# EAGLE design Miasma_fpb_R1_0 (EAGLE 6.6.0)
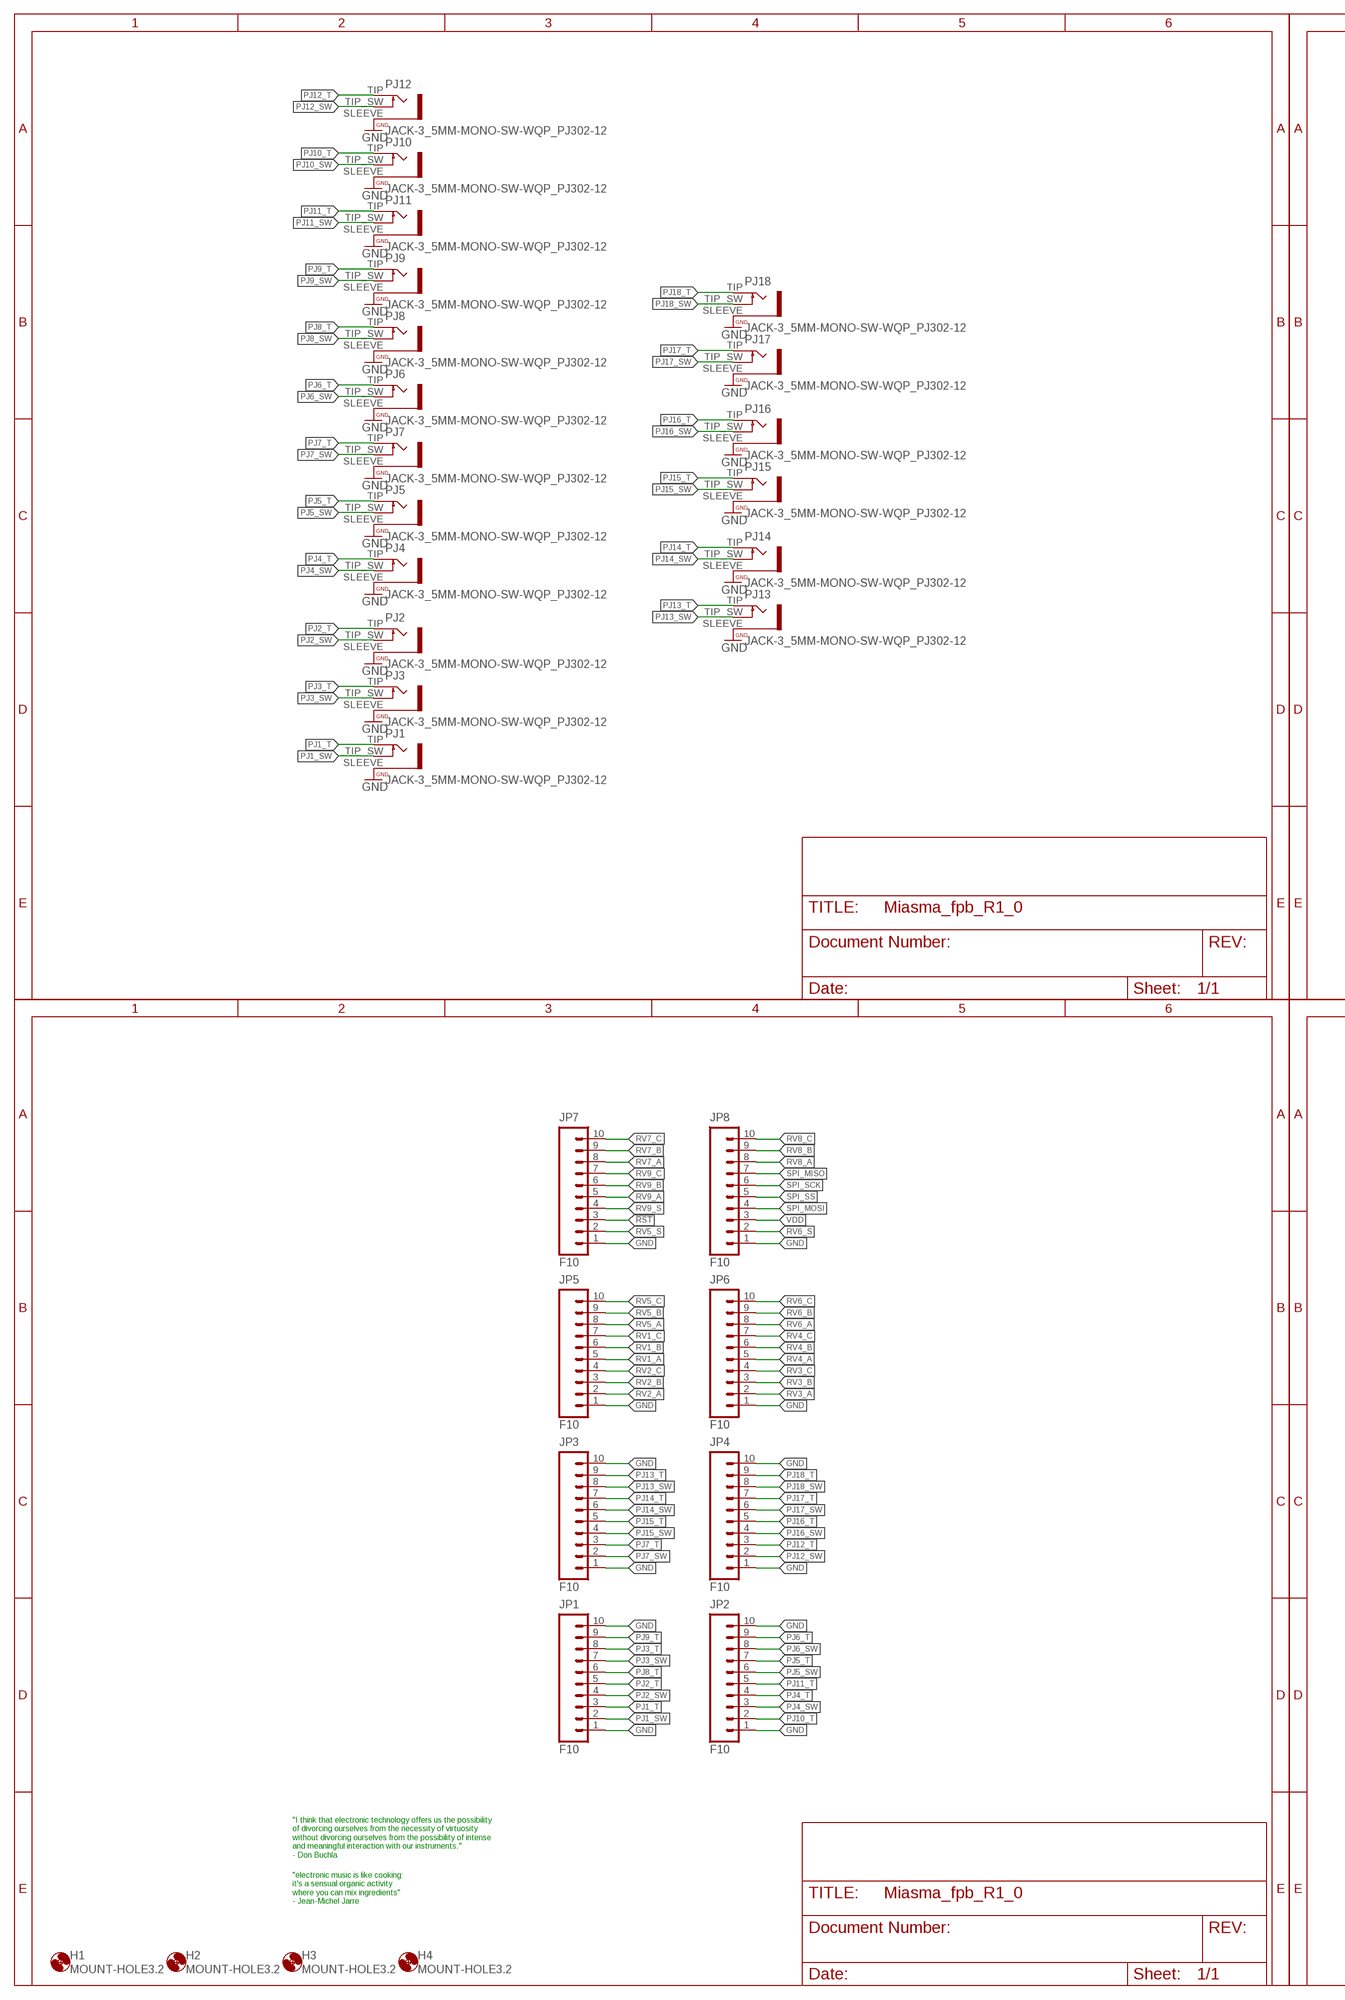
[diagram p0: schematic, sheet 1, part 1 of 2]
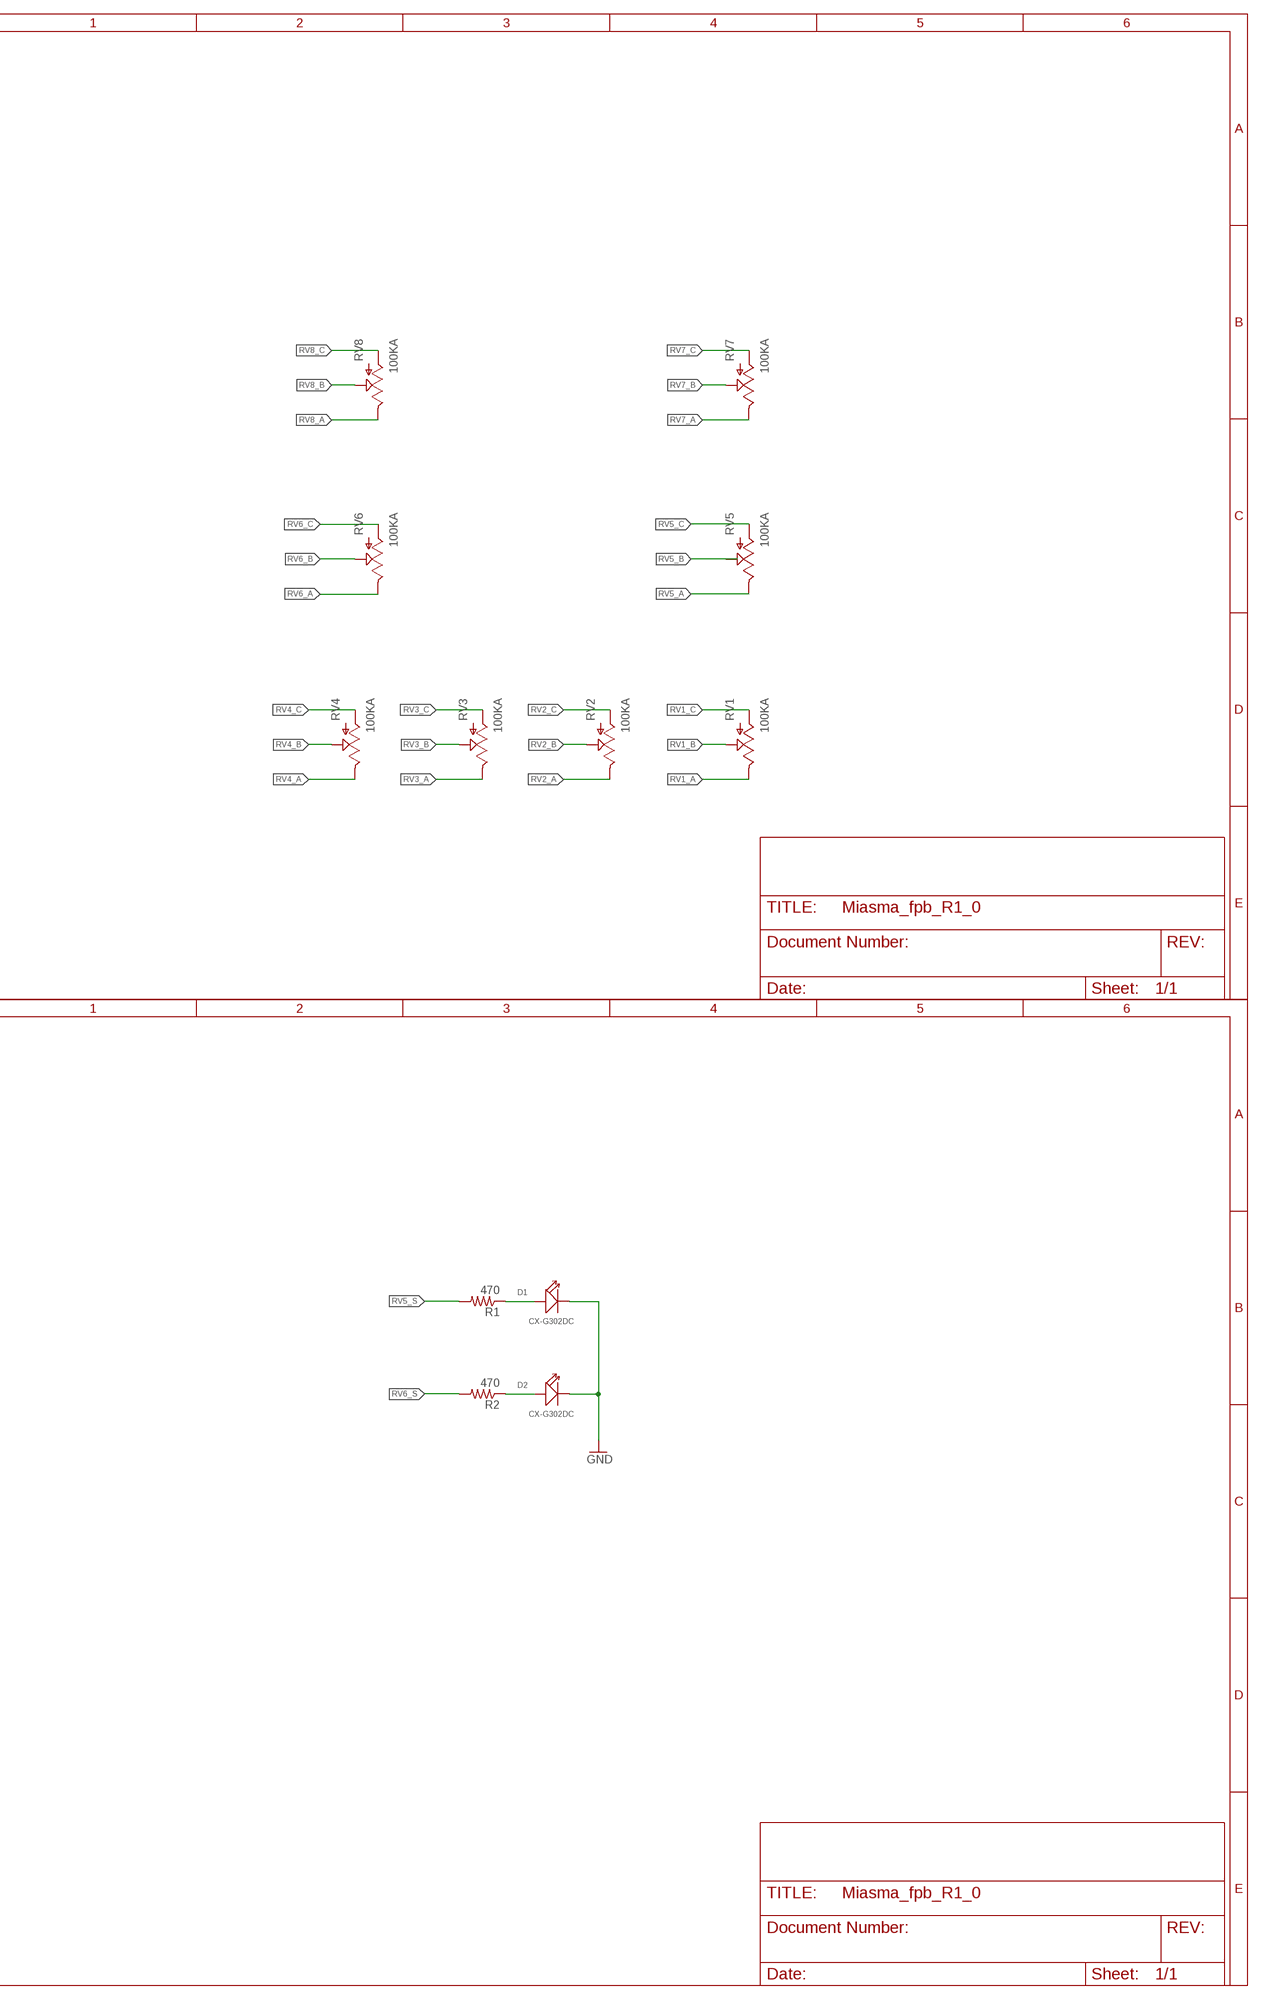
[diagram p1: schematic, sheet 1, part 2 of 2]

## Parts
D1  CX-G302DC  DIP-LED-GREEN-GREEN(2P-D3MM)  [LED2-2.54-D3.0MM]
D2  CX-G302DC  DIP-LED-GREEN-GREEN(2P-D3MM)  [LED2-2.54-D3.0MM]
H1  MOUNT-HOLE3.2  [3,2]
H2  MOUNT-HOLE3.2  [3,2]
H3  MOUNT-HOLE3.2  [3,2]
H4  MOUNT-HOLE3.2  [3,2]
JP1  F10  M10SILK_FEMALE_PTH  [1X10_OCTO]
JP2  F10  M10SILK_FEMALE_PTH  [1X10_OCTO]
JP3  F10  M10SILK_FEMALE_PTH  [1X10_OCTO]
JP4  F10  M10SILK_FEMALE_PTH  [1X10_OCTO]
JP5  F10  M10SILK_FEMALE_PTH  [1X10_OCTO]
JP6  F10  M10SILK_FEMALE_PTH  [1X10_OCTO]
JP7  F10  M10SILK_FEMALE_PTH  [1X10_OCTO]
JP8  F10  M10SILK_FEMALE_PTH  [1X10_OCTO]
PJ1  JACK-3_5MM-MONO-SW-WQP_PJ302-12  [WQP_PJ301M-12]
PJ2  JACK-3_5MM-MONO-SW-WQP_PJ302-12  [WQP_PJ301M-12]
PJ3  JACK-3_5MM-MONO-SW-WQP_PJ302-12  [WQP_PJ301M-12]
PJ4  JACK-3_5MM-MONO-SW-WQP_PJ302-12  [WQP_PJ301M-12]
PJ5  JACK-3_5MM-MONO-SW-WQP_PJ302-12  [WQP_PJ301M-12]
PJ6  JACK-3_5MM-MONO-SW-WQP_PJ302-12  [WQP_PJ301M-12]
PJ7  JACK-3_5MM-MONO-SW-WQP_PJ302-12  [WQP_PJ301M-12]
PJ8  JACK-3_5MM-MONO-SW-WQP_PJ302-12  [WQP_PJ301M-12]
PJ9  JACK-3_5MM-MONO-SW-WQP_PJ302-12  [WQP_PJ301M-12]
PJ10  JACK-3_5MM-MONO-SW-WQP_PJ302-12  [WQP_PJ301M-12]
PJ11  JACK-3_5MM-MONO-SW-WQP_PJ302-12  [WQP_PJ301M-12]
PJ12  JACK-3_5MM-MONO-SW-WQP_PJ302-12  [WQP_PJ301M-12]
PJ13  JACK-3_5MM-MONO-SW-WQP_PJ302-12  [WQP_PJ301M-12]
PJ14  JACK-3_5MM-MONO-SW-WQP_PJ302-12  [WQP_PJ301M-12]
PJ15  JACK-3_5MM-MONO-SW-WQP_PJ302-12  [WQP_PJ301M-12]
PJ16  JACK-3_5MM-MONO-SW-WQP_PJ302-12  [WQP_PJ301M-12]
PJ17  JACK-3_5MM-MONO-SW-WQP_PJ302-12  [WQP_PJ301M-12]
PJ18  JACK-3_5MM-MONO-SW-WQP_PJ302-12  [WQP_PJ301M-12]
R1  470  R-US_R0603  [R0603]
R2  470  R-US_R0603  [R0603]
RV1  100KA  POT  [ALPS_POT]
RV2  100KA  POT  [ALPS_POT]
RV3  100KA  POT  [ALPS_POT]
RV4  100KA  POT  [ALPS_POT]
RV5  100KA  POT  [ALPS_POT]
RV6  100KA  POT  [ALPS_POT]
RV7  100KA  POT  [ALPS_POT]
RV8  100KA  POT  [ALPS_POT]

## Nets
!RST: JP7.3
GND: D1.K(-) D2.K(-) JP1.1 JP1.10 JP2.1 JP2.10 JP3.1 JP3.10 JP4.1 JP4.10 JP5.1 JP6.1 JP7.1 JP8.1 PJ1.SLEEVE PJ2.SLEEVE PJ3.SLEEVE PJ4.SLEEVE PJ5.SLEEVE PJ6.SLEEVE PJ7.SLEEVE PJ8.SLEEVE PJ9.SLEEVE PJ10.SLEEVE PJ11.SLEEVE PJ12.SLEEVE PJ13.SLEEVE PJ14.SLEEVE PJ15.SLEEVE PJ16.SLEEVE PJ17.SLEEVE PJ18.SLEEVE
N$1: D1.A(+) R1.1
N$2: D2.A(+) R2.1
PJ1_SW: JP1.2 PJ1.TIP_SW
PJ1_T: JP1.3 PJ1.TIP
PJ2_SW: JP1.4 PJ2.TIP_SW
PJ2_T: JP1.5 PJ2.TIP
PJ3_SW: JP1.7 PJ3.TIP_SW
PJ3_T: JP1.8 PJ3.TIP
PJ4_SW: JP2.3 PJ4.TIP_SW
PJ4_T: JP2.4 PJ4.TIP
PJ5_SW: JP2.6 PJ5.TIP_SW
PJ5_T: JP2.7 PJ5.TIP
PJ6_SW: JP2.8 PJ6.TIP_SW
PJ6_T: JP2.9 PJ6.TIP
PJ7_SW: JP3.2 PJ7.TIP_SW
PJ7_T: JP3.3 PJ7.TIP
PJ8_SW: PJ8.TIP_SW
PJ8_T: JP1.6 PJ8.TIP
PJ9_SW: PJ9.TIP_SW
PJ9_T: JP1.9 PJ9.TIP
PJ10_SW: PJ10.TIP_SW
PJ10_T: JP2.2 PJ10.TIP
PJ11_SW: PJ11.TIP_SW
PJ11_T: JP2.5 PJ11.TIP
PJ12_SW: JP4.2 PJ12.TIP_SW
PJ12_T: JP4.3 PJ12.TIP
PJ13_SW: JP3.8 PJ13.TIP_SW
PJ13_T: JP3.9 PJ13.TIP
PJ14_SW: JP3.6 PJ14.TIP_SW
PJ14_T: JP3.7 PJ14.TIP
PJ15_SW: JP3.4 PJ15.TIP_SW
PJ15_T: JP3.5 PJ15.TIP
PJ16_SW: JP4.4 PJ16.TIP_SW
PJ16_T: JP4.5 PJ16.TIP
PJ17_SW: JP4.6 PJ17.TIP_SW
PJ17_T: JP4.7 PJ17.TIP
PJ18_SW: JP4.8 PJ18.TIP_SW
PJ18_T: JP4.9 PJ18.TIP
RV1_A: JP5.5 RV1.P$1
RV1_B: JP5.6 RV1.P$2
RV1_C: JP5.7 RV1.P$3
RV2_A: JP5.2 RV2.P$1
RV2_B: JP5.3 RV2.P$2
RV2_C: JP5.4 RV2.P$3
RV3_A: JP6.2 RV3.P$1
RV3_B: JP6.3 RV3.P$2
RV3_C: JP6.4 RV3.P$3
RV4_A: JP6.5 RV4.P$1
RV4_B: JP6.6 RV4.P$2
RV4_C: JP6.7 RV4.P$3
RV5_A: JP5.8 RV5.P$1
RV5_B: JP5.9 RV5.P$2
RV5_C: JP5.10 RV5.P$3
RV5_S: JP7.2 R1.2
RV6_A: JP6.8 RV6.P$1
RV6_B: JP6.9 RV6.P$2
RV6_C: JP6.10 RV6.P$3
RV6_S: JP8.2 R2.2
RV7_A: JP7.8 RV7.P$1
RV7_B: JP7.9 RV7.P$2
RV7_C: JP7.10 RV7.P$3
RV8_A: JP8.8 RV8.P$1
RV8_B: JP8.9 RV8.P$2
RV8_C: JP8.10 RV8.P$3
RV9_A: JP7.5
RV9_B: JP7.6
RV9_C: JP7.7
RV9_S: JP7.4
SPI_MISO: JP8.7
SPI_MOSI: JP8.4
SPI_SCK: JP8.6
SPI_SS: JP8.5
VDD: JP8.3

## Notes on the sheet
- "I think that electronic technology offers us the possibility 
  of divorcing ourselves from the necessity of virtuosity 
  without divorcing ourselves from the possibility of intense 
  and meaningful interaction with our instruments."
  - Don Buchla
- "electronic music is like cooking: 
  it's a sensual organic activity 
  where you can mix ingredients" 
  - Jean-Michel Jarre

## Library data of the parts
D1 D2 = Seeed-LED-2016:DIP-LED-GREEN-GREEN(2P-D3MM): 304090040; MPN: CX-G302DC
H1-H4 = oXo_Hardware:MOUNT-HOLE: MOUNTING HOLE with drill center marker
JP1-JP8 = oXo_Connectors:M10: Header 10 Standard 10-pin 0.1" header. Use with straight break away headers (SKU : PRT-00116), right angle break away headers (PRT-00553), swiss pins (PRT-00743), machine pins (PRT-00117), and female headers (PRT-00115).; PROD_ID: CONN-11563
PJ1-PJ18 = oXo_Connectors:JACK-3_5MM-MONO-SW: Jack, 3.5mm, RIght Angle, Though-Hole
R1 R2 = rcl:R-US_: RESISTOR, American symbol
RV1-RV8 = oXo_Potentiometers:POT; PROD_ID: RES-09177

## Board
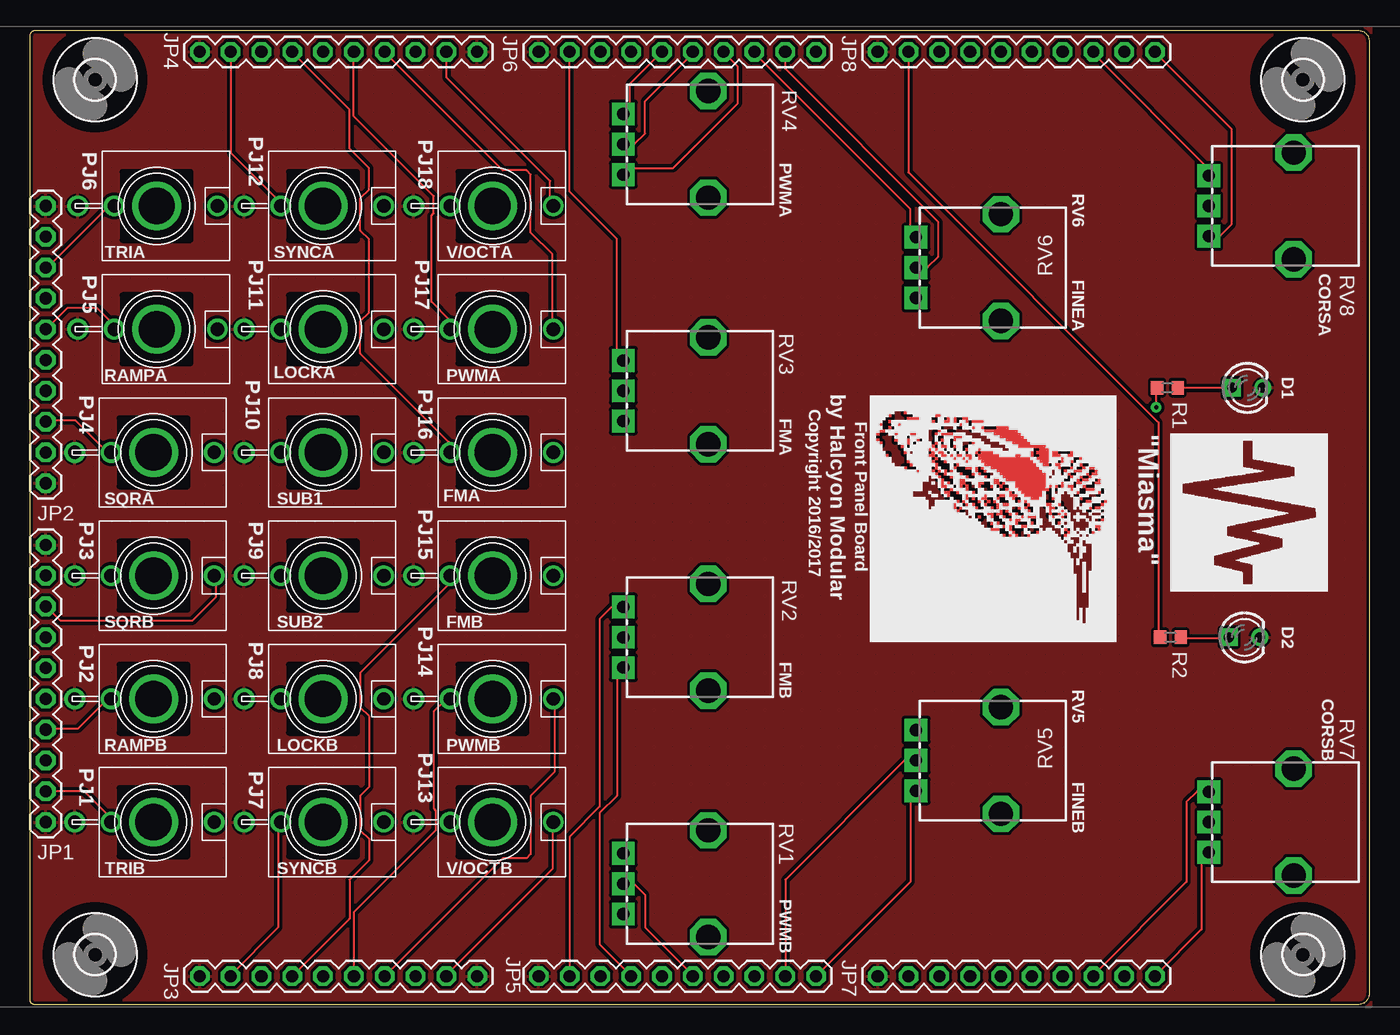
[diagram p2: board, top side]
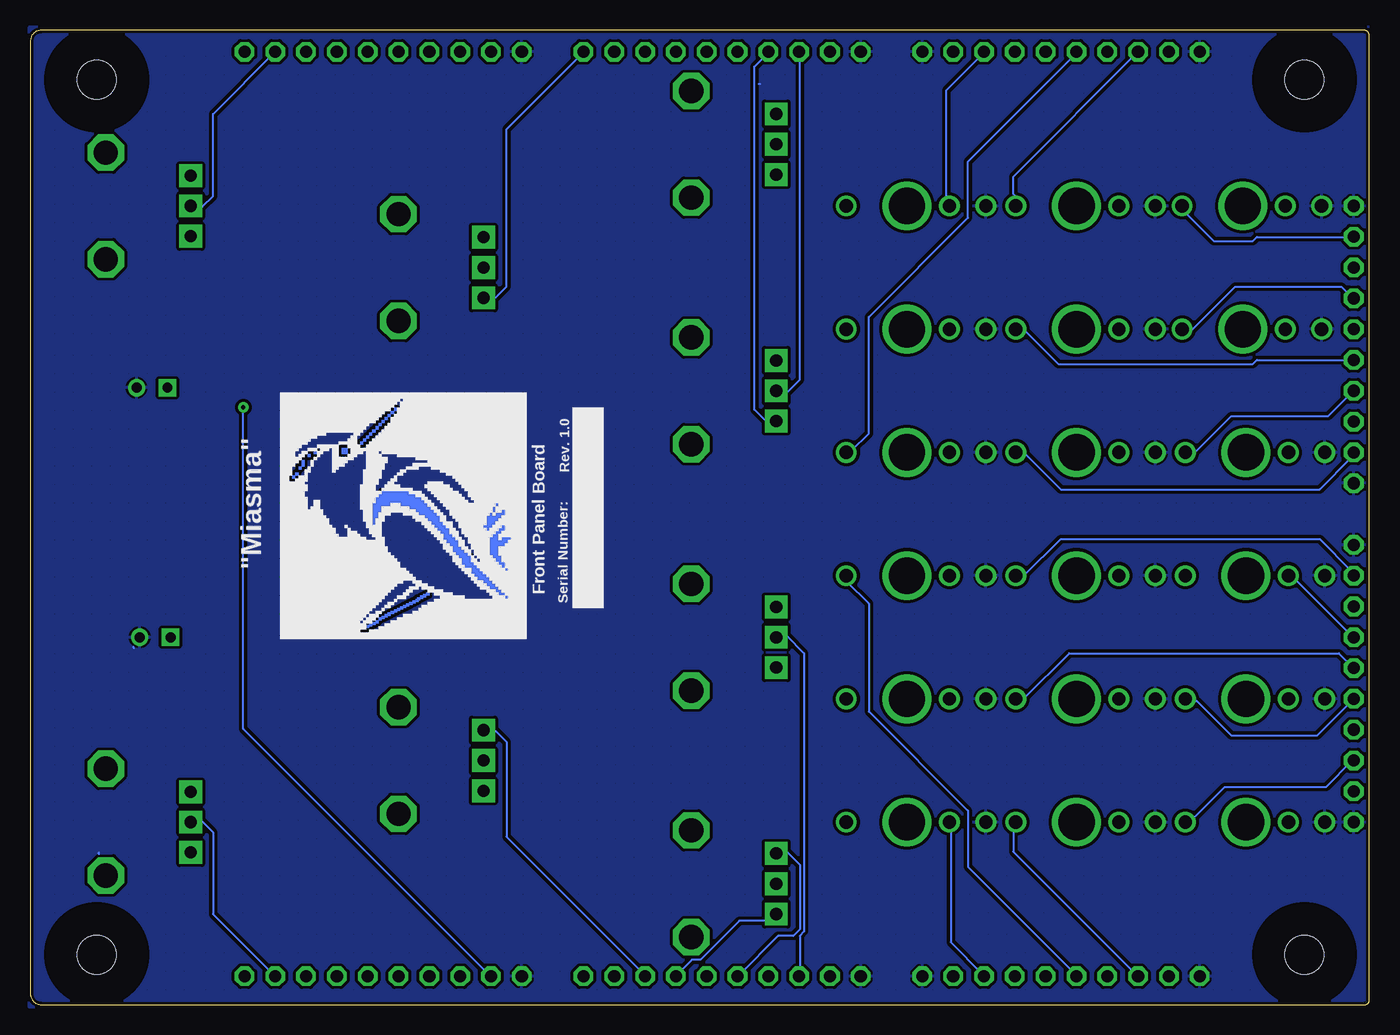
[diagram p3: board, bottom side, seen from below]

Size 110.36 x 80.32 mm. Coordinates in mm from the lower left corner, seen from the top.
Outline: 109.47,0 0.38,0 arc-90 0,0.31 0,79.94 arc-90 0.38,80.32 109.47,80.32 arc-90 110.36,79.43 110.36,0.87 arc-90 109.47,0
Copper layers (1*16): Top 0.035mm / dielectric 1.5mm / Bottom 0.035mm
Design rules "PatternAgents_7mil": minimum track width 7mil, minimum drill 14mil, track to track 7mil, track to pad 7mil, pad to pad 7mil, via to via 7mil, smd to smd 7mil, copper to edge 7mil, drill to drill 7mil, minimum pad ring 12mil, minimum via ring 10mil, stop-mask expansion 4mil, vias tented up to drill 25mil, thermal gap 7mil

### Footprints (pad centres in the part's own frame; a part is rotated, then mirrored left to right if it is on the bottom)
LED2-2.54-D3.0MM = drill 0.813 square: A -1.27,0 | drill 0.813: K 1.27,0
3,2 = hole 3.2: 0,0
1X10_OCTO = drill 1 octagon: 1 0,0; 2 2.54,0; 3 5.08,0; 4 7.62,0; 5 10.16,0; 6 12.7,0; 7 15.24,0; 8 17.78,0; 9 20.32,0; 10 22.86,0
WQP_PJ301M-12 = drill 3: HOLE 0,0 | drill 1.1: SLEEVE 0,-6.5; TIP 0,5; TIP_SW 0,-3.5
R0603 = smd 1 x 1.1: 1 -0.85,0; 2 0.85,0
ALPS_POT = drill 1 pad 1.88 square: P$1 7,-2.5; P$2 7,0; P$3 7,2.5 | drill 2 octagon: P$4 0,-4.4; P$5 0,4.4

### Placement (x,y rotation side)
D1  100.33,50.86 0 top
D2  100.08,30.28 0 top
H1  5.33,4.12 0 top
H2  5.33,76.26 0 top
H3  104.9,4.12 0 top
H4  104.9,76.26 0 top
JP1  1.27,15.04 90 top
JP2  1.27,42.98 90 top
JP3  13.97,2.34 0 top
JP4  13.97,78.54 0 top
JP5  41.91,2.34 0 top
JP6  41.91,78.54 0 top
JP7  69.85,2.34 0 top
JP8  69.85,78.54 0 top
PJ1  10.16,15.04 270 top
PJ2  10.16,25.2 270 top
PJ3  10.16,35.36 270 top
PJ4  10.16,45.52 270 top
PJ5  10.41,55.68 270 top
PJ6  10.41,65.84 270 top
PJ7  24.13,15.04 270 top
PJ8  24.13,25.2 270 top
PJ9  24.13,35.36 270 top
PJ10  24.13,45.52 270 top
PJ11  24.13,55.68 270 top
PJ12  24.13,65.84 270 top
PJ13  38.1,15.04 270 top
PJ14  38.1,25.2 270 top
PJ15  38.1,35.36 270 top
PJ16  38.1,45.52 270 top
PJ17  38.1,55.68 270 top
PJ18  38.1,65.84 270 top
R1  93.73,50.86 180 top
R2  93.98,30.28 180 top
RV1  55.88,9.96 180 top
RV2  55.88,30.28 180 top
RV3  55.88,50.6 180 top
RV4  55.88,70.92 180 top
RV5  80.01,20.12 180 top
RV6  80.01,60.76 180 top
RV7  104.14,15.04 180 top
RV8  104.14,65.84 180 top
U$1  [KINGFISH9_MED]  69.34,50.09 270 top
U$3  [KINGFISH_MED_TOPT]  69.6,30.28 90 bottom
U$9  [WAVE_MED]  106.93,34.09 90 top

### Tracks (layer width: path | path; a pad name or v marks a point on that pad's centre or on a via)
GND
  Bottom 0.178: 30.76,35.18 30.76,35.24 | 104.72,12.43 104.72,12.52 | 101.35,30.38 D2.K | 50.32,75.9 50.2,75.9 | 101.88,29.5 101.83,29.38
  pour Top (isolate 0.254, hatched): 0,-0.2 0,80.57 110.49,80.57 110.49,-0.2
  pour Bottom (isolate 0.254, hatched): 0,-0.2 0,80.57 110.49,80.57 110.49,-0.2
N$1
  Top 0.178: R1.1 94.59,50.83 99.03,50.83 D1.A
N$2
  Top 0.178: R2.1 94.94,30.21 98.68,30.21 D2.A
PJ1_SW
  Top 0.178: JP1.2 4.45,17.58 6.58,15.45 6.58,15.09 PJ1.TIP_SW
PJ1_T
  Bottom 0.178: JP1.3 1.42,20.07 3.56,17.94 11.91,17.94 14.76,15.09 15.11,15.09 PJ1.TIP
PJ2_SW
  Top 0.178: JP1.4 1.42,22.74 3.91,22.74 6.22,25.05 6.58,25.05 PJ2.TIP_SW
PJ2_T
  Bottom 0.178: JP1.5 4.27,22.21 11.38,22.21 14.22,25.05 15.11,25.05 PJ2.TIP
PJ3_SW
  Bottom 0.178: PJ3.TIP_SW 6.4,35.36 1.42,30.38 JP1.7
PJ3_T
  Top 0.178: JP1.8 1.42,32.7 2.49,31.63 13.34,31.63 15.29,33.58 15.29,35.36 PJ3.TIP
PJ4_SW
  Top 0.178: JP2.3 1.42,48.16 3.73,48.16 6.22,45.67 6.58,45.67 PJ4.TIP_SW
PJ4_T
  Bottom 0.178: JP2.4 1.42,50.48 3.38,48.52 11.38,48.52 14.22,45.67 15.11,45.67 PJ4.TIP
PJ5_SW
  Top 0.178: JP2.6 1.42,55.81 3.02,57.41 5.51,57.41 6.76,56.17 6.76,55.81 PJ5.TIP_SW
PJ5_T
  Bottom 0.178: JP2.7 1.42,58.3 2.31,59.19 11.02,59.19 14.58,55.63 15.29,55.63 PJ5.TIP
PJ6_SW
  Top 0.178: JP2.8 1.42,60.79 6.4,65.77 6.76,65.77 PJ6.TIP_SW
PJ6_T
  Bottom 0.178: JP2.9 1.42,63.28 9.25,63.28 9.6,62.92 12.8,62.92 15.29,65.41 15.29,65.77 PJ6.TIP
PJ7_SW
  Top 0.178: JP3.2 16.54,2.47 20.45,6.38 20.45,14.74 20.62,14.92 PJ7.TIP_SW
PJ7_T
  Bottom 0.178: JP3.3 19.2,2.47 29.34,12.6 29.34,14.74 29.16,14.92 PJ7.TIP
PJ8_T
  Bottom 0.178: JP1.6 2.49,28.96 24.71,28.96 28.45,25.23 28.98,25.23 PJ8.TIP
PJ9_T
  Bottom 0.178: PJ9.TIP 28.45,35.36 25.42,38.39 4.09,38.39 1.42,35.72 1.42,35.36 JP1.9
PJ10_T
  Bottom 0.178: JP2.2 1.42,45.5 1.42,45.14 4.09,42.47 25.42,42.47 28.45,45.5 28.98,45.5 PJ10.TIP
PJ11_T
  Bottom 0.178: JP2.5 9.25,53.14 9.6,52.79 25.6,52.79 28.45,55.63 28.98,55.63 PJ11.TIP
PJ12_SW
  Top 0.178: JP4.2 16.54,78.39 16.54,70.21 20.8,65.94 PJ12.TIP_SW
PJ12_T
  Bottom 0.178: JP4.3 29.34,68.26 29.34,66.83 29.16,66.66 29.16,65.94 PJ12.TIP
PJ13_SW
  Bottom 0.178: JP3.8 31.83,2.47 34.49,5.14 34.49,14.92 PJ13.TIP_SW
PJ13_T
  Top 0.178: JP3.9 34.31,2.47 43.03,11.18 43.03,14.92 PJ13.TIP
PJ14_SW
  Top 0.178: JP3.6 26.67,7.63 33.43,14.38 33.43,15.98 33.25,16.16 33.25,24.16 34.14,25.05 34.49,25.05 PJ14.TIP_SW
PJ14_T
  Top 0.178: JP3.7 38.94,12.07 40.89,12.07 41.25,12.43 41.25,17.23 43.2,19.18 43.2,25.05 PJ14.TIP
PJ15_SW
  Top 0.178: JP3.4 21.69,2.47 26.31,7.09 26.31,10.29 27.91,11.89 27.91,13.67 27.2,14.38 27.2,17.23 27.91,17.94 27.91,23.81 27.2,24.52 27.2,27.36 34.49,34.65 34.49,35.36 PJ15.TIP_SW
PJ15_T
  Bottom 0.178: JP3.5 24.18,2.47 33.07,11.36 33.07,15.98 41.25,24.16 41.25,33.05 43.03,34.83 43.03,35.36 PJ15.TIP
PJ16_SW
  Top 0.178: JP4.4 21.69,78.39 26.31,73.77 26.31,70.57 27.91,68.97 27.91,67.19 27.2,66.48 27.2,63.81 27.91,63.1 27.91,57.05 27.2,56.34 27.2,53.68 34.49,46.39 34.49,45.67 PJ16.TIP_SW
PJ16_T
  Bottom 0.178: JP4.5 24.18,78.39 33.07,69.5 33.07,64.88 41.25,56.7 41.25,47.1 42.67,45.67 43.03,45.67 PJ16.TIP
PJ17_SW
  Top 0.178: JP4.6 26.67,73.23 33.25,66.66 33.25,65.23 33.07,65.06 33.07,57.94 34.49,56.52 34.49,55.81 PJ17.TIP_SW
PJ17_T
  Top 0.178: JP4.7 29.34,78.39 38.94,68.79 40.89,68.79 41.25,68.43 41.25,63.63 43.03,61.85 43.03,55.81 PJ17.TIP
PJ18_SW
  Bottom 0.178: JP4.8 31.83,78.39 34.85,75.37 34.85,66.12 34.67,65.94 PJ18.TIP_SW
PJ18_T
  Top 0.178: JP4.9 34.31,78.39 34.31,76.43 42.85,67.9 42.85,66.12 43.03,65.94 PJ18.TIP
RV1_A
  Bottom 0.178: JP5.5 51.92,2.47 48.72,5.67 47.47,5.67 46.94,6.2 46.94,11.54 48.01,12.6 48.72,12.6 RV1.P$1
RV1_B
  Top 0.178: JP5.6 54.59,2.47 50.67,6.38 50.67,9.05 49.78,9.94 48.89,9.94 RV1.P$2
RV1_C
  Bottom 0.178: JP5.7 57.07,2.47 55.83,3.71 55.12,3.71 51.92,6.91 49.43,6.91 48.89,7.45 RV1.P$3
RV2_A
  Top 0.178: JP5.2 44.45,13.85 46.94,16.34 46.94,31.81 48.01,32.87 48.72,32.87 RV2.P$1
RV2_B
  Bottom 0.178: JP5.3 46.94,2.47 46.94,5.67 46.58,6.03 46.58,28.96 48.01,30.38 48.72,30.38 RV2.P$2
RV2_C
  Top 0.178: JP5.4 49.43,2.47 46.94,4.96 46.94,15.8 48.36,17.23 48.36,27.36 48.72,27.72 RV2.P$3
RV3_A
  Top 0.178: JP6.2 44.45,67.01 48.36,63.1 48.36,53.5 48.72,53.14 RV3.P$1
RV3_B
  Bottom 0.178: JP6.3 46.94,78.39 46.94,51.54 48.01,50.48 48.72,50.48 RV3.P$2
RV3_C
  Bottom 0.178: JP6.4 49.61,78.39 50.67,77.32 50.67,49.05 49.78,48.16 48.89,48.16 RV3.P$3
RV4_A
  Top 0.178: JP6.5 49.43,75.9 49.43,74.12 48.89,73.59 RV4.P$1
RV4_B
  Top 0.178: RV4.P$2 49.78,70.92 50.67,71.81 50.67,74.48 54.59,78.39 JP6.6
RV4_C
  Top 0.178: JP6.7 57.25,78.39 58.32,77.32 58.32,74.3 52.98,68.97 49.43,68.97 48.89,68.43 RV4.P$3
RV5_A
  Bottom 0.178: JP5.8 59.74,2.47 71.12,13.85 71.12,21.67 72.01,22.56 72.9,22.56 RV5.P$1
RV5_B
  Top 0.178: JP5.9 62.23,10.29 72.01,20.07 72.9,20.07 RV5.P$2
RV5_C
  Top 0.178: JP5.10 72.54,10.11 72.54,17.23 72.9,17.58 RV5.P$3
RV5_S  (via drill 0.36)
  Top 0.178: v92.81,49.23 92.81,50.83 R1.2
  Bottom 0.178: v92.81,49.23 92.81,22.74 72.54,2.47 JP7.2
RV6_A
  Top 0.178: JP6.8 59.74,78.39 72.54,65.59 72.54,63.63 72.9,63.28 RV6.P$1
RV6_B
  Top 0.178: JP6.9 62.23,77.15 74.85,64.52 74.85,61.68 73.97,60.79 73.08,60.79 RV6.P$2
RV6_C
  Bottom 0.178: JP6.10 64.9,78.39 71.12,72.17 71.12,59.19 72.01,58.3 72.9,58.3 RV6.P$3
RV6_S
  Top 0.178: R2.2 92.99,30.38 92.99,47.99 72.36,68.61 72.36,78.39 JP8.2
RV7_A
  Top 0.178: JP7.8 87.66,2.47 95.3,10.11 95.3,16.69 96.19,17.58 97.08,17.58 RV7.P$1
RV7_B
  Bottom 0.178: JP7.9 90.32,2.47 95.3,7.45 95.3,14.2 96.19,15.09 97.08,15.09 RV7.P$2
RV7_C
  Top 0.178: JP7.10 92.81,2.47 96.55,6.2 96.55,11.89 97.08,12.43 RV7.P$3
RV8_A
  Top 0.178: JP8.8 87.66,78.39 97.08,68.97 97.08,68.43 RV8.P$1
RV8_B
  Bottom 0.178: JP8.9 95.3,73.41 95.3,66.66 96.19,65.77 97.08,65.77 RV8.P$2
RV8_C
  Top 0.178: JP8.10 92.81,78.39 99.03,72.17 99.03,64.34 98.15,63.45 97.26,63.45 RV8.P$3

### Text on the board
tPlace: PWMA | RV6 | TRIA | SYNCA | V/OCTA | FINEA | CORSA | RAMPA | LOCKA | PWMA | by Halcyon Modular | FMA | Copyright 2016/2017 | Front Panel Board | "Miasma" | FMA | SQRA | SUB1 | SQRB | SUB2 | FMB | FMB | RV5 | CORSB | RAMPB | LOCKB | PWMB | FINEB | TRIB | SYNCB | V/OCTB | PWMB
bPlace: Rev. 1.0 | "Miasma" | Front Panel Board | Serial Number: